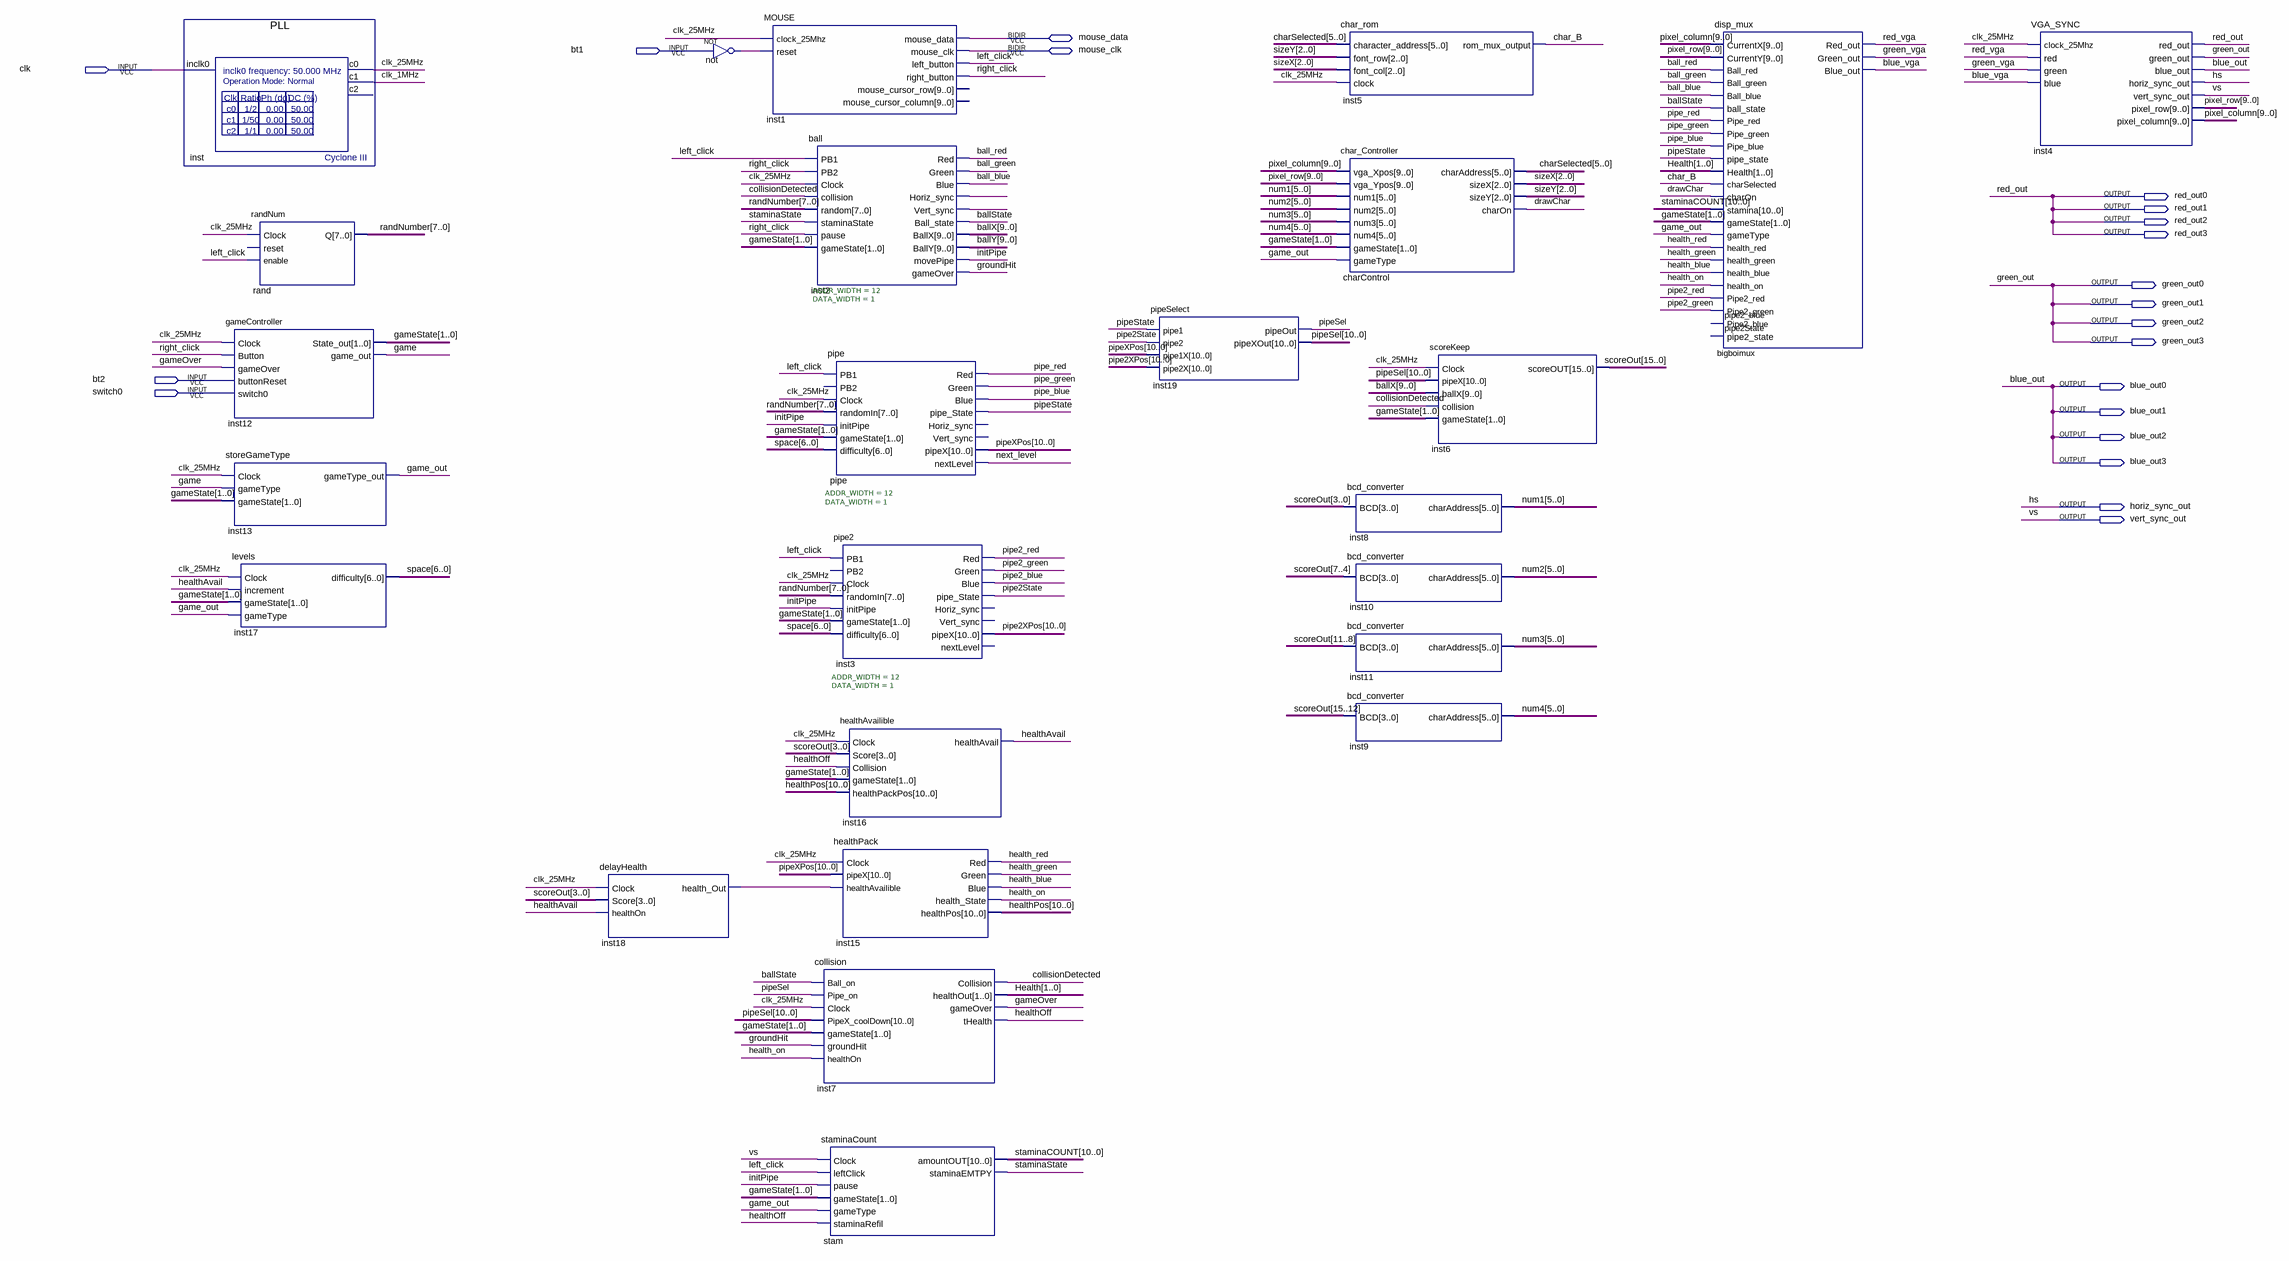
[diagram p0: schematic sheet]
// Quartus schematic project305_blockSchematic.bdf as structural Verilog: 25 symbols, 20 pins
module project305_blockSchematic (
  input  bt1,
  input  clk,
  input  bt2,
  input  switch0,
  inout  mouse_data,
  inout  mouse_clk,
  output red_out0,
  output red_out1,
  output red_out2,
  output red_out3,
  output green_out0,
  output green_out1,
  output green_out2,
  output green_out3,
  output blue_out0,
  output blue_out1,
  output blue_out2,
  output blue_out3,
  output horiz_sync_out,
  output vert_sync_out
);

  wire ball_blue, ball_green, ball_red, ballState, blue_vga, char_B, clk_1MHz, clk_25MHz, collisionDetected,
       drawChar, game, game_out, gameOver, green_vga, groundHit, health_blue, health_green, health_on,
       health_red, healthAvail, healthOff, initPipe, inst2_horiz_sync, inst2_vert_sync, inst18_health_out,
       left_click, next_level, not_out, pipe2_blue, pipe2_green, pipe2_red, pipe2State, pipe_blue,
       pipe_green, pipe_red, pipeSel_1bit, pipeState, red_vga, right_click, staminaState;
  wire [1:0] gameState, Health;
  wire [2:0] sizeX, sizeY;
  wire [5:0] charSelected, num1, num2, num3, num4;
  wire [6:0] space;
  wire [7:0] randNumber;
  wire [9:0] ballX, ballY, pixel_column, pixel_row;
  wire [10:0] healthPos, pipe2XPos, pipeSel, pipeXPos, staminaCOUNT;
  wire [15:0] scoreOut;

  PLL inst (.inclk0(clk), .c0(clk_25MHz), .c1(clk_1MHz));  // open: c2
  gameController inst12 (
    .Clock(clk_25MHz), .Button(right_click), .gameOver(gameOver), .buttonReset(bt2), .switch0(switch0),
    .State_out(gameState), .game_out(game));
  storeGameType inst13 (.Clock(clk_25MHz), .gameType(game), .gameState(gameState), .gameType_out(game_out));
  levels inst17 (
    .Clock(clk_25MHz), .increment(healthAvail), .gameState(gameState), .gameType(game_out), .difficulty(space));
  randNum \rand  (.Clock(clk_25MHz), .enable(left_click), .Q(randNumber));  // open: reset
  delayHealth inst18 (.Clock(clk_25MHz), .Score(scoreOut[3:0]), .healthOn(healthAvail), .health_Out(inst18_health_out));
  not \not  (not_out, bt1);
  MOUSE inst1 (
    .clock_25Mhz(clk_25MHz), .reset(not_out), .left_button(left_click), .right_button(right_click),
    .mouse_data(mouse_data), .mouse_clk(mouse_clk));  // open: mouse_cursor_row, mouse_cursor_column
  ball #(.ADDR_WIDTH(12), .DATA_WIDTH(1)) inst2 (
    .PB1(left_click), .PB2(right_click), .Clock(clk_25MHz), .collision(collisionDetected),
    .random(randNumber), .staminaState(staminaState), .pause(right_click), .gameState(gameState),
    .Red(ball_red), .Green(ball_green), .Blue(ball_blue), .Horiz_sync(inst2_horiz_sync),
    .Vert_sync(inst2_vert_sync), .Ball_state(ballState), .BallX(ballX), .BallY(ballY), .movePipe(initPipe),
    .gameOver(groundHit));
  pipe #(.ADDR_WIDTH(12), .DATA_WIDTH(1)) pipe (
    .PB1(left_click), .Clock(clk_25MHz), .randomIn(randNumber), .initPipe(initPipe), .gameState(gameState),
    .difficulty(space), .Red(pipe_red), .Green(pipe_green), .Blue(pipe_blue), .pipe_State(pipeState),
    .pipeX(pipeXPos), .nextLevel(next_level));  // open: PB2, Horiz_sync, Vert_sync
  pipe2 #(.ADDR_WIDTH(12), .DATA_WIDTH(1)) inst3 (
    .PB1(left_click), .Clock(clk_25MHz), .randomIn(randNumber), .initPipe(initPipe), .gameState(gameState),
    .difficulty(space), .Red(pipe2_red), .Green(pipe2_green), .Blue(pipe2_blue), .pipe_State(pipe2State),
    .pipeX(pipe2XPos));  // open: PB2, Horiz_sync, Vert_sync, nextLevel
  healthAvailible inst16 (
    .Clock(clk_25MHz), .Score(scoreOut[3:0]), .Collision(healthOff), .gameState(gameState),
    .healthPackPos(healthPos), .healthAvail(healthAvail));
  healthPack inst15 (
    .Clock(clk_25MHz), .pipeX(pipeXPos), .healthAvailible(inst18_health_out), .Red(health_red),
    .Green(health_green), .Blue(health_blue), .health_State(health_on), .healthPos(healthPos));
  collision inst7 (
    .Ball_on(ballState), .Pipe_on(pipeSel_1bit), .Clock(clk_25MHz), .PipeX_coolDown(pipeSel),
    .gameState(gameState), .groundHit(groundHit), .healthOn(health_on), .Collision(collisionDetected),
    .healthOut(Health), .gameOver(gameOver), .tHealth(healthOff));
  staminaCount stam (
    .Clock(vert_sync_out), .leftClick(left_click), .pause(initPipe), .gameState(gameState),
    .gameType(game_out), .staminaRefil(healthOff), .amountOUT(staminaCOUNT), .staminaEMTPY(staminaState));
  pipeSelect inst19 (
    .pipe1(pipeState), .pipe2(pipe2State), .pipe1X(pipeXPos), .pipe2X(pipe2XPos), .pipeOut(pipeSel_1bit),
    .pipeXOut(pipeSel));
  char_rom inst5 (
    .character_address(charSelected), .font_row(sizeY), .font_col(sizeX), .clock(clk_25MHz),
    .rom_mux_output(char_B));
  char_Controller charControl (
    .vga_Xpos(pixel_column), .vga_Ypos(pixel_row), .num1(num1), .num2(num2), .num3(num3), .num4(num4),
    .gameState(gameState), .gameType(game_out), .charAddress(charSelected), .sizeX(sizeX), .sizeY(sizeY),
    .charOn(drawChar));
  bcd_converter inst8 (.BCD(scoreOut[3:0]), .charAddress(num1));
  bcd_converter inst10 (.BCD(scoreOut[7:4]), .charAddress(num2));
  bcd_converter inst11 (.BCD(scoreOut[11:8]), .charAddress(num3));
  bcd_converter inst9 (.BCD(scoreOut[15:12]), .charAddress(num4));
  scoreKeep inst6 (
    .Clock(clk_25MHz), .pipeX(pipeSel), .ballX(ballX), .collision(collisionDetected), .gameState(gameState),
    .scoreOUT(scoreOut));
  disp_mux bigboimux (
    .CurrentX(pixel_column), .CurrentY(pixel_row), .Ball_red(ball_red), .Ball_green(ball_green),
    .Ball_blue(ball_blue), .ball_state(ballState), .Pipe_red(pipe_red), .Pipe_green(pipe_green),
    .Pipe_blue(pipe_blue), .pipe_state(pipeState), .Health(Health), .charSelected(char_B), .charOn(drawChar),
    .stamina(staminaCOUNT), .gameState(gameState), .gameType(game_out), .health_red(health_red),
    .health_green(health_green), .health_blue(health_blue), .health_on(health_on), .Pipe2_red(pipe2_red),
    .Pipe2_green(pipe2_green), .Pipe2_blue(pipe2_blue), .pipe2_state(pipe2State), .Red_out(red_vga),
    .Green_out(green_vga), .Blue_out(blue_vga));
  VGA_SYNC inst4 (
    .clock_25Mhz(clk_25MHz), .red(red_vga), .green(green_vga), .blue(blue_vga), .red_out(red_out0),
    .green_out(green_out0), .blue_out(blue_out0), .horiz_sync_out(horiz_sync_out),
    .vert_sync_out(vert_sync_out), .pixel_row(pixel_row), .pixel_column(pixel_column));

  assign blue_out1 = blue_out0;
  assign blue_out2 = blue_out0;
  assign blue_out3 = blue_out0;
  assign green_out1 = green_out0;
  assign green_out2 = green_out0;
  assign green_out3 = green_out0;
  assign red_out1 = red_out0;
  assign red_out2 = red_out0;
  assign red_out3 = red_out0;

  // Other names for the same wires on the sheet: blue_out = blue_out0; green_out = green_out0; hs = horiz_sync_out;
  //   red_out = red_out0; vs = vert_sync_out
endmodule
